# EAGLE schematic ssslidar_v0.1_blade_SIG (EAGLE 7.6.0)
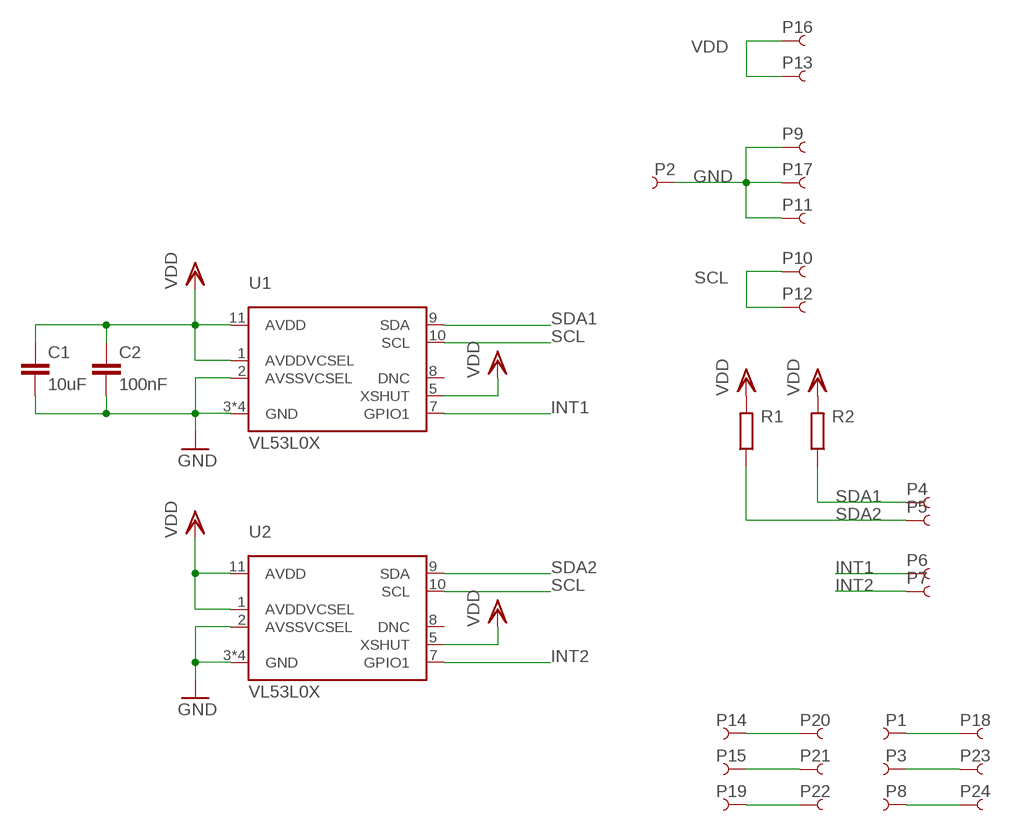
[diagram p0: schematic, sheet 1]

## Parts
C1  10uF  C0805  [0805_N]
C2  100nF  C0402  [0402_N]
P1  PIN_SMD_0.8X1_RECT  [PIN_SMD_0.8X1_RECT]
P2  PIN_SMD_1X1_RECT  [PIN_SMD_1X1_RECT]
P3  PIN_SMD_0.8X1_RECT  [PIN_SMD_0.8X1_RECT]
P4  PIN_SMD_0.8X1_RECT  [PIN_SMD_0.8X1_RECT]
P5  PIN_SMD_0.8X1_RECT  [PIN_SMD_0.8X1_RECT]
P6  PIN_SMD_0.8X1_RECT  [PIN_SMD_0.8X1_RECT]
P7  PIN_SMD_0.8X1_RECT  [PIN_SMD_0.8X1_RECT]
P8  PIN_SMD_0.8X1_RECT  [PIN_SMD_0.8X1_RECT]
P9  PIN_SMD_1X1_RECT  [PIN_SMD_1X1_RECT]
P10  PIN_SMD_0.8X1_RECT  [PIN_SMD_0.8X1_RECT]
P11  PIN_SMD_1X1_RECT  [PIN_SMD_1X1_RECT]
P12  PIN_SMD_0.8X1_RECT  [PIN_SMD_0.8X1_RECT]
P13  PIN_SMD_0.8X1_RECT  [PIN_SMD_0.8X1_RECT]
P14  PIN_SMD_0.8X1_RECT  [PIN_SMD_0.8X1_RECT]
P15  PIN_SMD_0.8X1_RECT  [PIN_SMD_0.8X1_RECT]
P16  PIN_SMD_0.8X1_RECT  [PIN_SMD_0.8X1_RECT]
P17  PIN_SMD_1X1_RECT  [PIN_SMD_1X1_RECT]
P18  PIN_SMD_0.8X1_RECT  [PIN_SMD_0.8X1_RECT]
P19  PIN_SMD_0.8X1_RECT  [PIN_SMD_0.8X1_RECT]
P20  PIN_SMD_0.8X1_RECT  [PIN_SMD_0.8X1_RECT]
P21  PIN_SMD_0.8X1_RECT  [PIN_SMD_0.8X1_RECT]
P22  PIN_SMD_0.8X1_RECT  [PIN_SMD_0.8X1_RECT]
P23  PIN_SMD_0.8X1_RECT  [PIN_SMD_0.8X1_RECT]
P24  PIN_SMD_0.8X1_RECT  [PIN_SMD_0.8X1_RECT]
R1  R0402  [0402_N]
R2  R0402  [0402_N]
U1  VL53L0X  [VL53L0X]
U2  VL53L0X  [VL53L0X]

## Nets
GND: C1.2 C2.2 P2.PIN P9.PIN P11.PIN P17.PIN U1.2(AVSSVCSEL) U1.3(GND) U1.4(GND) U1.6(GND) U1.12(GND) U2.2(AVSSVCSEL) U2.3(GND) U2.4(GND) U2.6(GND) U2.12(GND)
INT1: P6.PIN U1.7(GPIO1)
INT2: P7.PIN U2.7(GPIO1)
N$1: P14.PIN P20.PIN
N$2: P15.PIN P21.PIN
N$3: P19.PIN P22.PIN
N$4: P1.PIN P18.PIN
N$5: P3.PIN P23.PIN
N$6: P8.PIN P24.PIN
SCL: P10.PIN P12.PIN U1.10(SCL) U2.10(SCL)
SDA1: P4.PIN R2.1 U1.9(SDA)
SDA2: P5.PIN R1.1 U2.9(SDA)
VDD: C1.1 C2.1 P13.PIN P16.PIN R1.2 R2.2 U1.1(AVDDVCSEL) U1.5(XSHUT) U1.11(AVDD) U2.1(AVDDVCSEL) U2.5(XSHUT) U2.11(AVDD)
Unconnected: U1.8(DNC) U2.8(DNC)

## Library data of the parts
C1 C2 = Xevelabs:C: Non-polarized Capacitor
P1-P24 = Xevelabs:PIN
R1 R2 = Xevelabs:R: Resistor
U1 U2 = VL53L0X:VL53L0X: VL53L0X distance sensor